# EAGLE schematic ControllerSchematic (EAGLE 9.7.0)
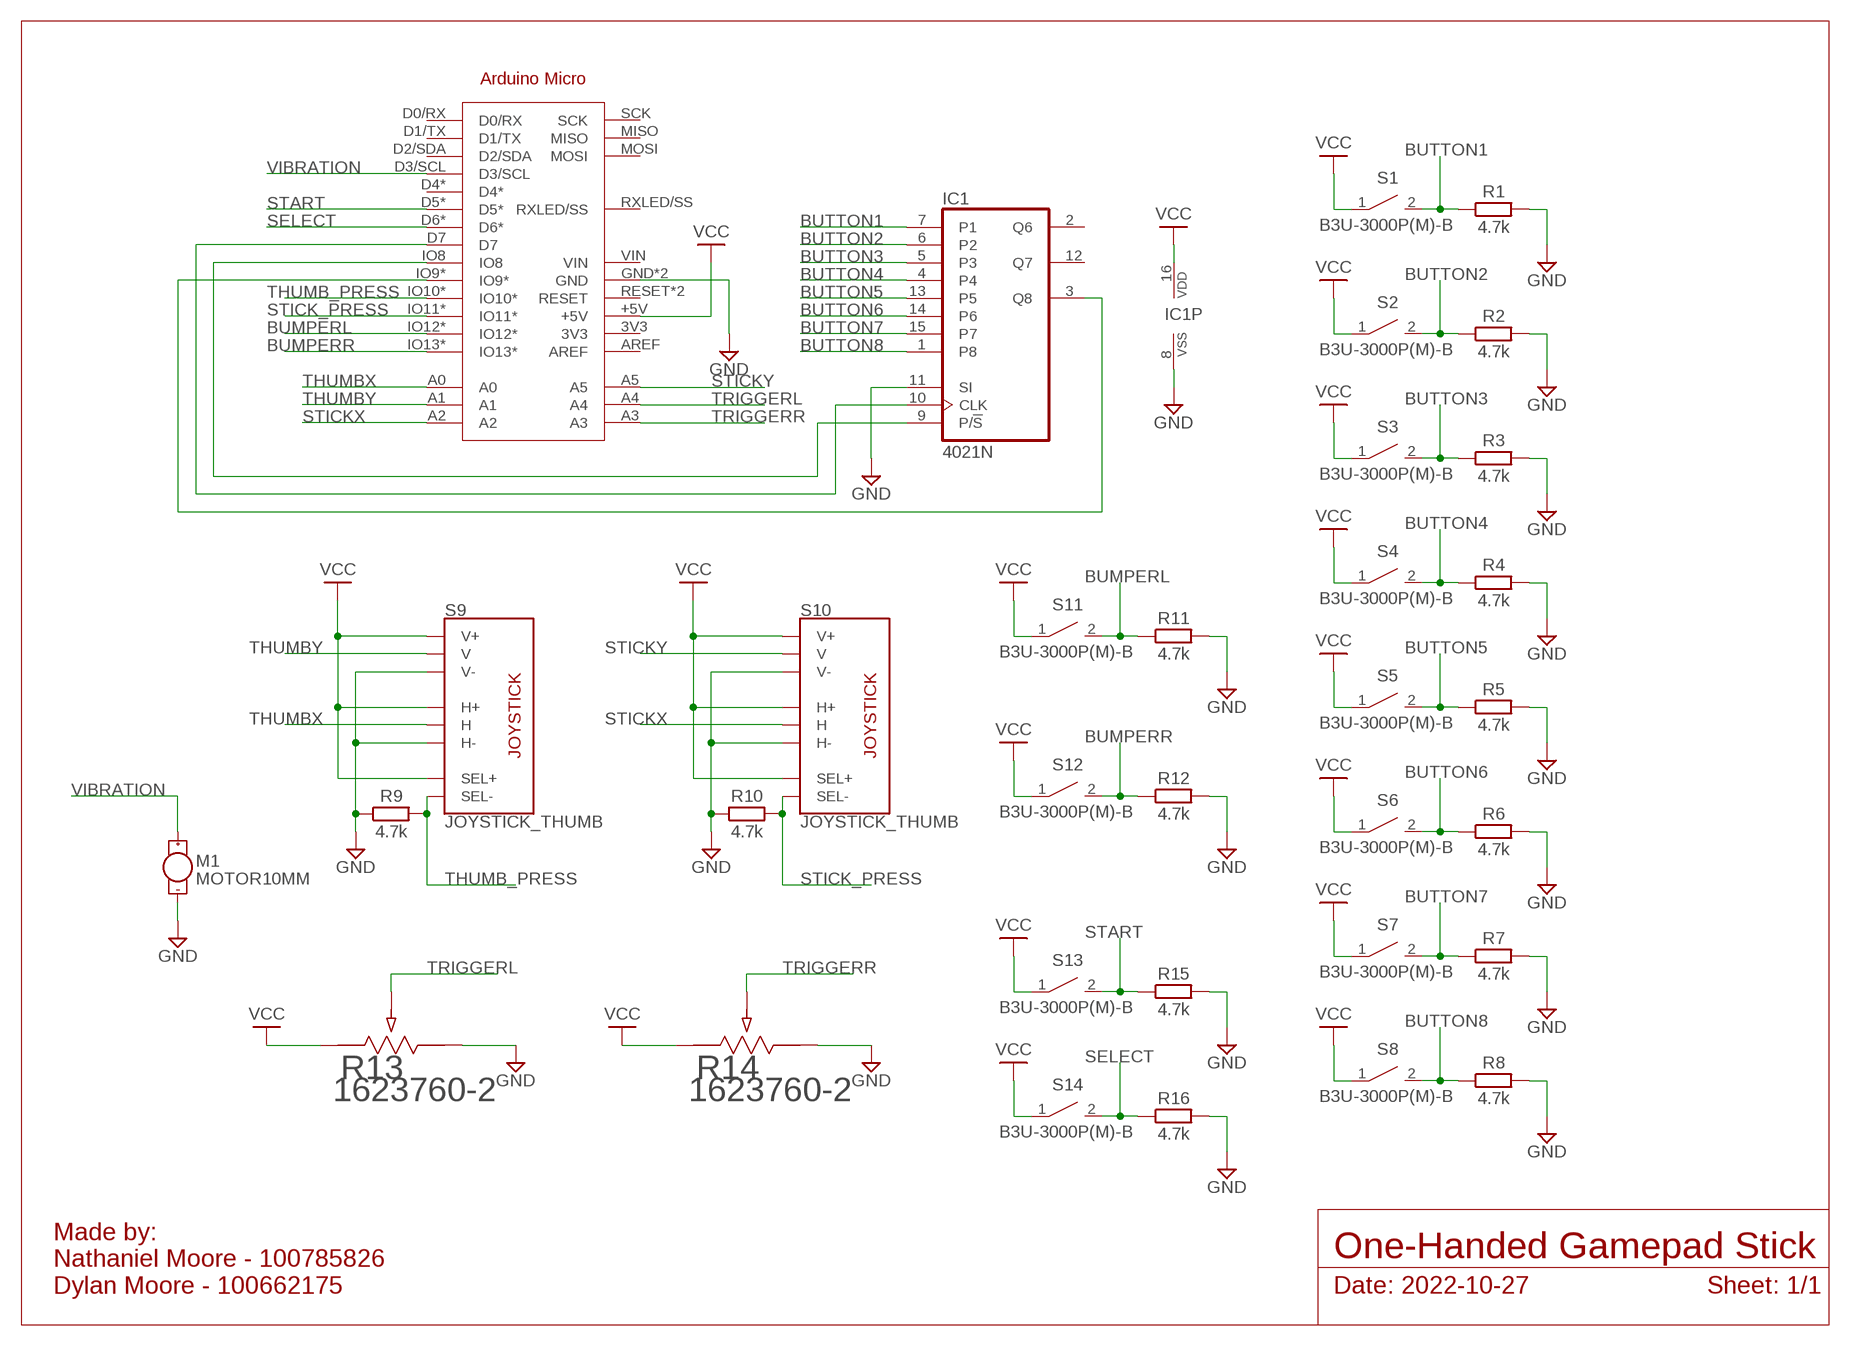
[diagram p0: schematic, sheet 1]

## Parts
IC1  4021N  [DIL16]
M1  MOTOR10MM  [VIBE-MOTOR-10MM]
R1  4.7k  R_AXIAL-7.2MM-PITCH  [RESAD724W46L381D178B]
R2  4.7k  R_AXIAL-7.2MM-PITCH  [RESAD724W46L381D178B]
R3  4.7k  R_AXIAL-7.2MM-PITCH  [RESAD724W46L381D178B]
R4  4.7k  R_AXIAL-7.2MM-PITCH  [RESAD724W46L381D178B]
R5  4.7k  R_AXIAL-7.2MM-PITCH  [RESAD724W46L381D178B]
R6  4.7k  R_AXIAL-7.2MM-PITCH  [RESAD724W46L381D178B]
R7  4.7k  R_AXIAL-7.2MM-PITCH  [RESAD724W46L381D178B]
R8  4.7k  R_AXIAL-7.2MM-PITCH  [RESAD724W46L381D178B]
R9  4.7k  R_AXIAL-7.2MM-PITCH  [RESAD724W46L381D178B]
R10  4.7k  R_AXIAL-7.2MM-PITCH  [RESAD724W46L381D178B]
R11  4.7k  R_AXIAL-7.2MM-PITCH  [RESAD724W46L381D178B]
R12  4.7k  R_AXIAL-7.2MM-PITCH  [RESAD724W46L381D178B]
R13  1623760-2  [POT_1623757-2]
R14  1623760-2  [POT_1623757-2]
R15  4.7k  R_AXIAL-7.2MM-PITCH  [RESAD724W46L381D178B]
R16  4.7k  R_AXIAL-7.2MM-PITCH  [RESAD724W46L381D178B]
S1  B3U-3000P(M)-B  B3U-X000B3U3000P(M)-B3000P(M)-B  [B3U-3000P(M)-B]
S2  B3U-3000P(M)-B  B3U-X000B3U3000P(M)-B3000P(M)-B  [B3U-3000P(M)-B]
S3  B3U-3000P(M)-B  B3U-X000B3U3000P(M)-B3000P(M)-B  [B3U-3000P(M)-B]
S4  B3U-3000P(M)-B  B3U-X000B3U3000P(M)-B3000P(M)-B  [B3U-3000P(M)-B]
S5  B3U-3000P(M)-B  B3U-X000B3U3000P(M)-B3000P(M)-B  [B3U-3000P(M)-B]
S6  B3U-3000P(M)-B  B3U-X000B3U3000P(M)-B3000P(M)-B  [B3U-3000P(M)-B]
S7  B3U-3000P(M)-B  B3U-X000B3U3000P(M)-B3000P(M)-B  [B3U-3000P(M)-B]
S8  B3U-3000P(M)-B  B3U-X000B3U3000P(M)-B3000P(M)-B  [B3U-3000P(M)-B]
S9  JOYSTICK_THUMB  [JOYSTICK]
S10  JOYSTICK_THUMB  [JOYSTICK]
S11  B3U-3000P(M)-B  B3U-X000B3U3000P(M)-B3000P(M)-B  [B3U-3000P(M)-B]
S12  B3U-3000P(M)-B  B3U-X000B3U3000P(M)-B3000P(M)-B  [B3U-3000P(M)-B]
S13  B3U-3000P(M)-B  B3U-X000B3U3000P(M)-B3000P(M)-B  [B3U-3000P(M)-B]
S14  B3U-3000P(M)-B  B3U-X000B3U3000P(M)-B3000P(M)-B  [B3U-3000P(M)-B]
U$1  ARDUINOMICRO  [ARDUINOMICRO]

## Nets
BUMPERL: R11.1 S11.2 U$1.IO12*
BUMPERR: R12.1 S12.2 U$1.IO13*
BUTTON1: IC1.7(P1) R1.1 S1.2
BUTTON2: IC1.6(P2) R2.1 S2.2
BUTTON3: IC1.5(P3) R3.1 S3.2
BUTTON4: IC1.4 R4.1 S4.2
BUTTON5: IC1.13(P5) R5.1 S5.2
BUTTON6: IC1.14(P6) R6.1 S6.2
BUTTON7: IC1.15(P7) R7.1 S7.2
BUTTON8: IC1.1(P8) R8.1 S8.2
GND: IC1.8(VSS) IC1.11(SI) M1.- R1.2 R2.2 R3.2 R4.2 R5.2 R6.2 R7.2 R8.2 R9.1 R10.1 R11.2 R12.2 R13.3 R14.3 R15.2 R16.2 S9.H3(H-) S9.V3(V-) S10.H3(H-) S10.V3(V-) U$1.GND U$1.GND1(GND)
N$1: IC1.10(CLK) U$1.D7
N$2: IC1.9(P/!S) U$1.IO8
N$9: IC1.3(Q8) U$1.IO9*
SELECT: R16.1 S14.2 U$1.D6*
START: R15.1 S13.2 U$1.D5*
STICK_PRESS: R10.2 S10.B2A(SEL-) U$1.IO11*
STICKX: S10.H2(H) U$1.A2
STICKY: S10.V2(V) U$1.A5
THUMB_PRESS: R9.2 S9.B2A(SEL-) U$1.IO10*
THUMBX: S9.H2(H) U$1.A0
THUMBY: S9.V2(V) U$1.A1
TRIGGERL: R13.2 U$1.A4
TRIGGERR: R14.2 U$1.A3
VCC: IC1.16(VDD) R13.1 R14.1 S1.1 S2.1 S3.1 S4.1 S5.1 S6.1 S7.1 S8.1 S9.B1A(SEL+) S9.H1(H+) S9.V1(V+) S10.B1A(SEL+) S10.H1(H+) S10.V1(V+) S11.1 S12.1 S13.1 S14.1 U$1.+5V
VIBRATION: M1.+ U$1.D3/SCL
Unconnected: IC1.2(Q6) IC1.12(Q7) U$1.3V3 U$1.AREF U$1.D0/RX U$1.D1/TX U$1.D2/SDA U$1.D4* U$1.MISO U$1.MOSI U$1.RESET U$1.RESET1(RESET) U$1.RXLED/SS U$1.SCK U$1.VIN

## Notes on the sheet
- One-Handed Gamepad Stick
- Made by:
  Nathaniel Moore - 100785826
  Dylan Moore - 100662175
- Date: 2022-10-27 | Sheet: 1/1

## Library data of the parts
IC1 = 40xx:4021: 8-bit static SHIFT REGISTER
M1 = SparkFun-Electromechanical:MOTOR: Motor (Single-Phase) Two-terminal, single-phase motors. SparkFun Products Vibration Motor <https://www.sparkfun.com/products/8449> (ROB-08449) Physical dimension and wire connections for this powerful vibration motor. Motor has a self adhesive backing.; PROD_ID: COMP-08572; SF_SKU: ROB-08449
R1-R12 R15 R16 = Resistor:R: Resistor Fixed - Generic; CATEGORY: Resistor; SUB-CATEGORY: Fixed
R13 R14 = Resistors:1623760-2; BUILT_BY: EMA_UL_Team; CATEGORY: Potentiometers; COPYRIGHT: Copyright (C) 2016 Accelerated Designs. All rights reserved; DESCRIPTION: 23E 10KA 6.35X50FL B7 CAT; MANUFACTURER_PART_NUMBER: 23ESA103MMF50NF; PART_STATUS: active; SERIES: Unknown; VENDOR: TE Connectivity
S1-S8 S11-S14 = Switch:B3U-X000: Ultra-small Tactile Switch Contact form : SPST-NO Datasheet <https://omronfs.omron.com/en_US/ecb/products/pdf/en-b3u.pdf>; CATEGORY: SWITCH; DESCRIPTION: Ultra-small Surface-mounting Tactile Switches with High Contact Reliability; MANUFACTURER: OMRON; OPERATING_TEMPERATURE: -25°C to +70°C; PART_STATUS: ACTIVE; ROHS_COMPLIANCE: RoHS Compliant; SERIES: B3U; TYPE: Tactile
S9 S10 = SparkFun-Switches:JOYSTICK_THUMB: Analog Thumb Joystick This is a joystick very similar to the ‘analog’ joysticks on PS2 (PlayStation 2) controllers. Directional movements are simply two potentiometers - one for each axis. Pots are ~10k each. This joystick also has a select button that is actuated when the joystick is pressed down. SparkFun Products Thumb Joystick <https://www.sparkfun.com/products/9032> (COM-09032) SparkFun Thumb Joystick Breakout <https://www.sparkfun.com/products/9110> (BOB-09110) SparkFun Joystick Shield Kit <https://www.sparkfun.com/products/9760> (DEV-09760); PROD_ID: COMP-09744; SF_SKU: COM-09032
U$1 = ArduinoMicro:ARDUINOMICRO